# EasyEDA schematic EasyEDA_PCB_VTimer_button.json
TITLE: VTimer Button PCB; REV: 1.0; Date: 2021-05-28; Sheet: 1/1; Drawn By: Andrew Wong; Company: Your Company
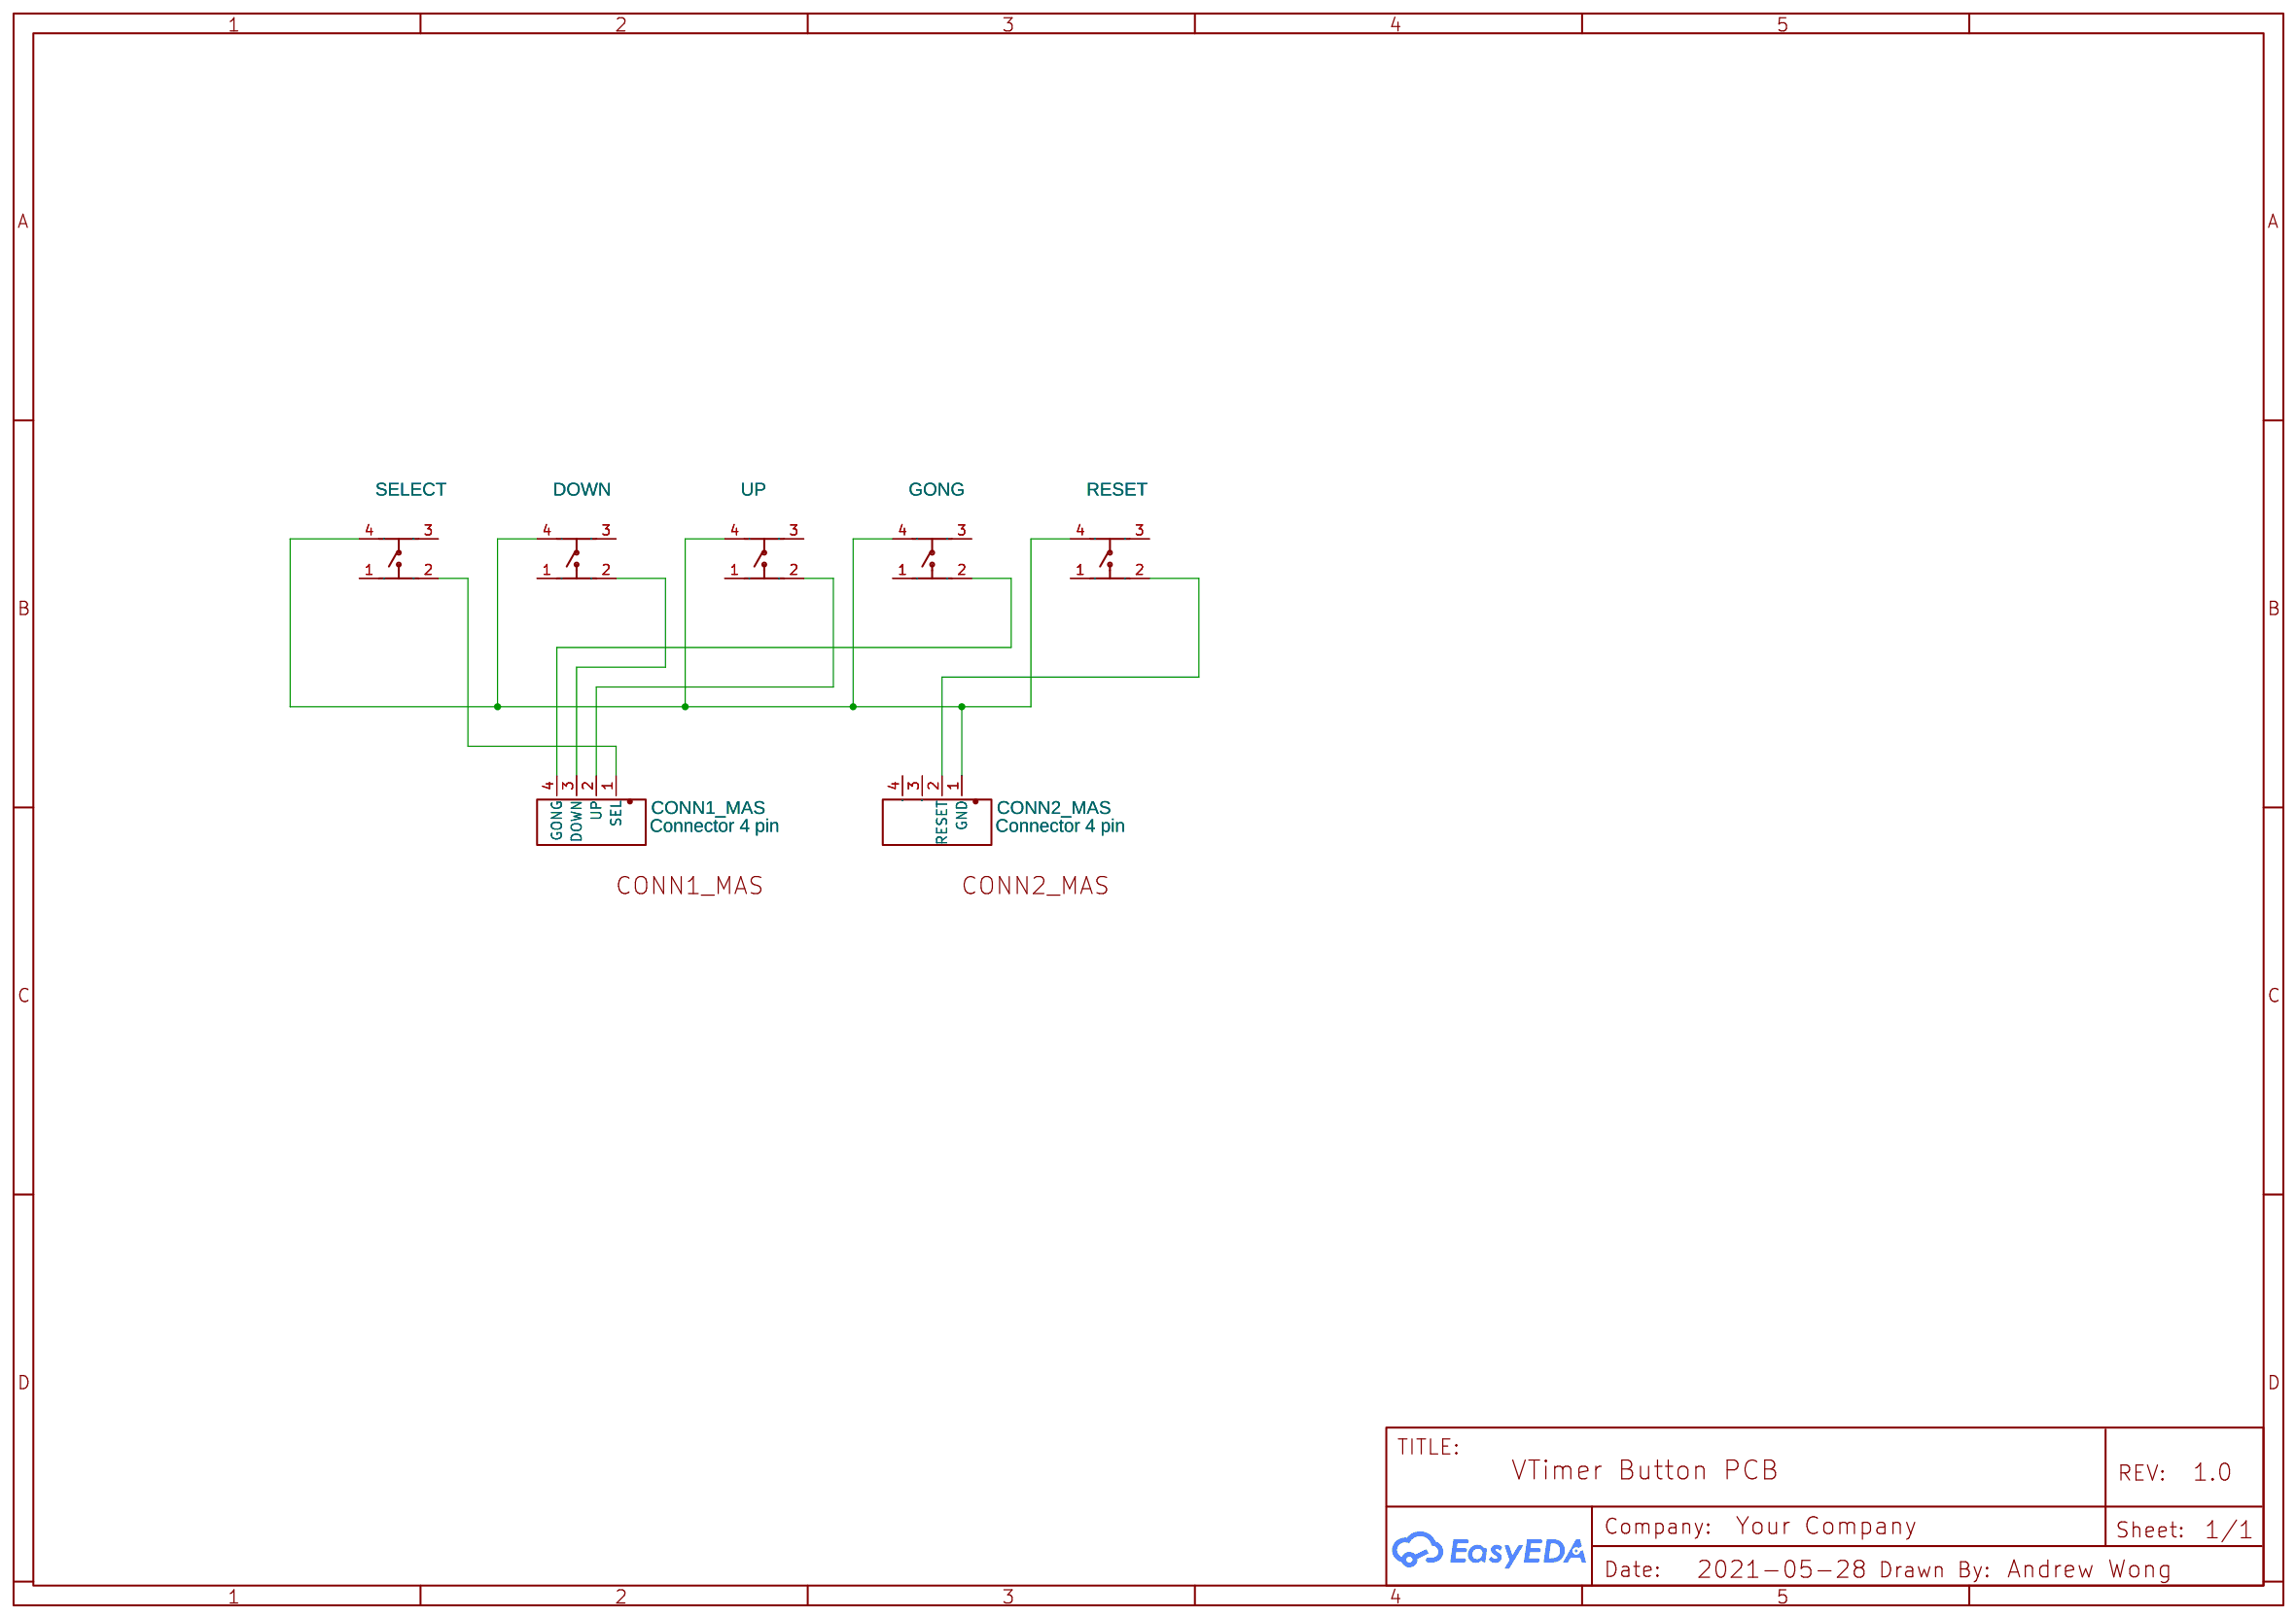
[diagram p0: schematic sheet]

## Parts
CONN1_MAS  Connector 4 pin  [CONNECTOR 4 PIN]
CONN2_MAS  Connector 4 pin  [CONNECTOR 4 PIN]
DOWN  DOWN  [KEY-TH_4P-L11.7-W11.5-P5.00-LS12.5]
GONG  GONG  [KEY-TH_4P-L11.7-W11.5-P5.00-LS12.5]
RESET  RESET  [KEY-TH_4P-L11.7-W11.5-P5.00-LS12.5]
SELECT  SELECT  [KEY-TH_4P-L11.7-W11.5-P5.00-LS12.5]
UP  UP  [KEY-TH_4P-L11.7-W11.5-P5.00-LS12.5]

## Library data of the parts
CONN1_MAS CONN2_MAS = Connector 4 pin: Supplier: LCSC; Manufacturer: BOOMELE; Manufacturer Part: Connector KF2510-8A; Supplier Part: C27837; Contributor: Hari priya
DOWN GONG RESET SELECT UP = TL1100DF160Q: Supplier: LCSC; Supplier Part: C273460; Manufacturer: E-Switch; Contributor: LCSC; JLCPCB Part Class: Extended Part

## Nets
Net-(CONN1_MAS-1): CONN1_MAS.1(SEL) SELECT.2
Net-(CONN1_MAS-2): CONN1_MAS.2(UP) UP.2
Net-(CONN1_MAS-3): CONN1_MAS.3(DOWN) DOWN.2
Net-(CONN1_MAS-4): CONN1_MAS.4(GONG) GONG.2
Net-(CONN2_MAS-1): CONN2_MAS.1(GND) DOWN.4 GONG.4 RESET.4 SELECT.4 UP.4
Net-(CONN2_MAS-2): CONN2_MAS.2(RESET) RESET.2

Not connected (* = marked no-connect by the designer): CONN2_MAS 3 4; DOWN 1 3; GONG 1 3; RESET 1 3; SELECT 1 3; UP 1 3
